# EAGLE design Adafruit NeoPixel Ring 24 B - Holder 4 (EAGLE 9.6.2)
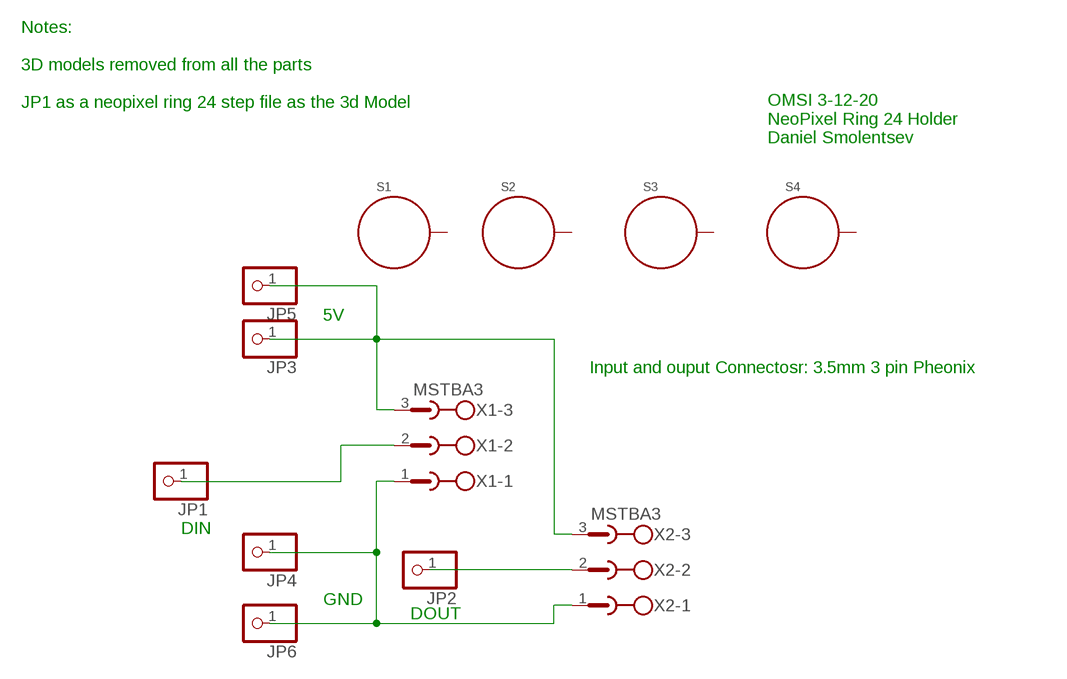
[diagram p0: schematic, sheet 1]

## Parts
JP1  PINHD-1X1CB  [1X01-CLEANBIG]
JP2  PINHD-1X1CB  [1X01-CLEANBIG]
JP3  PINHD-1X1CB  [1X01-CLEANBIG]
JP4  PINHD-1X1CB  [1X01-CLEANBIG]
JP5  PINHD-1X1CB  [1X01-CLEANBIG]
JP6  PINHD-1X1CB  [1X01-CLEANBIG]
S1  STANDOFF_ELECTRICAL.17"  [STANDOFF-ELECTRICAL]
S2  STANDOFF_ELECTRICAL.17"  [STANDOFF-ELECTRICAL]
S3  STANDOFF_ELECTRICAL.17"  [STANDOFF-ELECTRICAL]
S4  STANDOFF_ELECTRICAL.17"  [STANDOFF-ELECTRICAL]
X1  MSTBA3  [MSTBA3]
X2  MSTBA3  [MSTBA3]

## Nets
5V: JP3.1 JP5.1 X1.3 X2.3
DIN: JP1.1 X1.2
GND: JP4.1 JP6.1 X1.1 X2.1
N$1: JP2.1 X2.2
Unconnected: S1.P1 S2.P1 S3.P1 S4.P1

## Notes on the sheet
- Notes:
  
  3D models removed from all the parts
  
  JP1 as a neopixel ring 24 step file as the 3d Model
- OMSI 3-12-20
  NeoPixel Ring 24 Holder
  Daniel Smolentsev
- 5V
- Input and ouput Connectosr: 3.5mm 3 pin Pheonix
- DIN
- GND
- DOUT

## Library data of the parts
JP1-JP6 = NeoPixelRing:PINHD-1X1: Pin header 1x1 for 0.1" spacing With round pins
S1-S4 = th_libraries:STANDOFF_ELECTRICAL: A standoff intended to be an electrically connected point. Pad size and stop size allow for a #8 Phillips pan screw head to make a solid connection to the board. Added 144mill drill hole that fits my normal wood screw
X1 X2 = th_libraries:MSTBA3: PHOENIX; MF: FARNELL; MPN: 1757255; OC_FARNELL: 3705183; OC_NEWARK: 71C4162

## Board
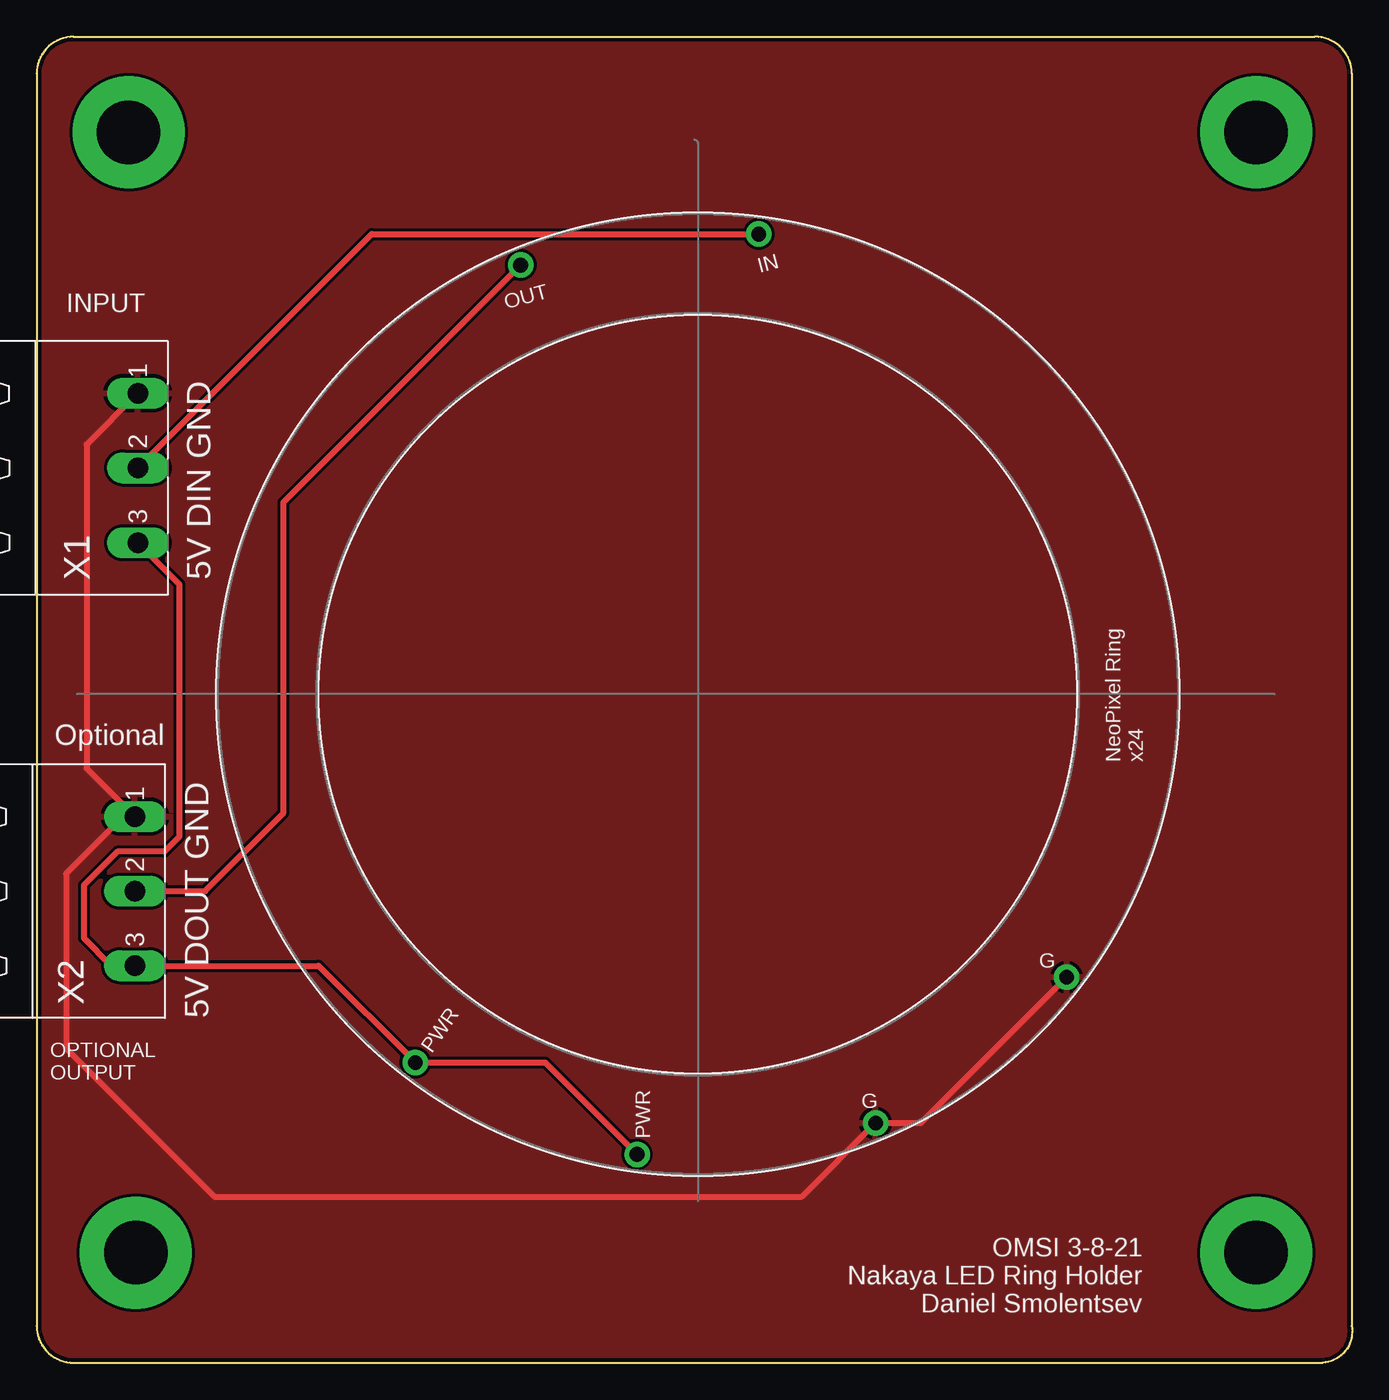
[diagram p1: board, top side]
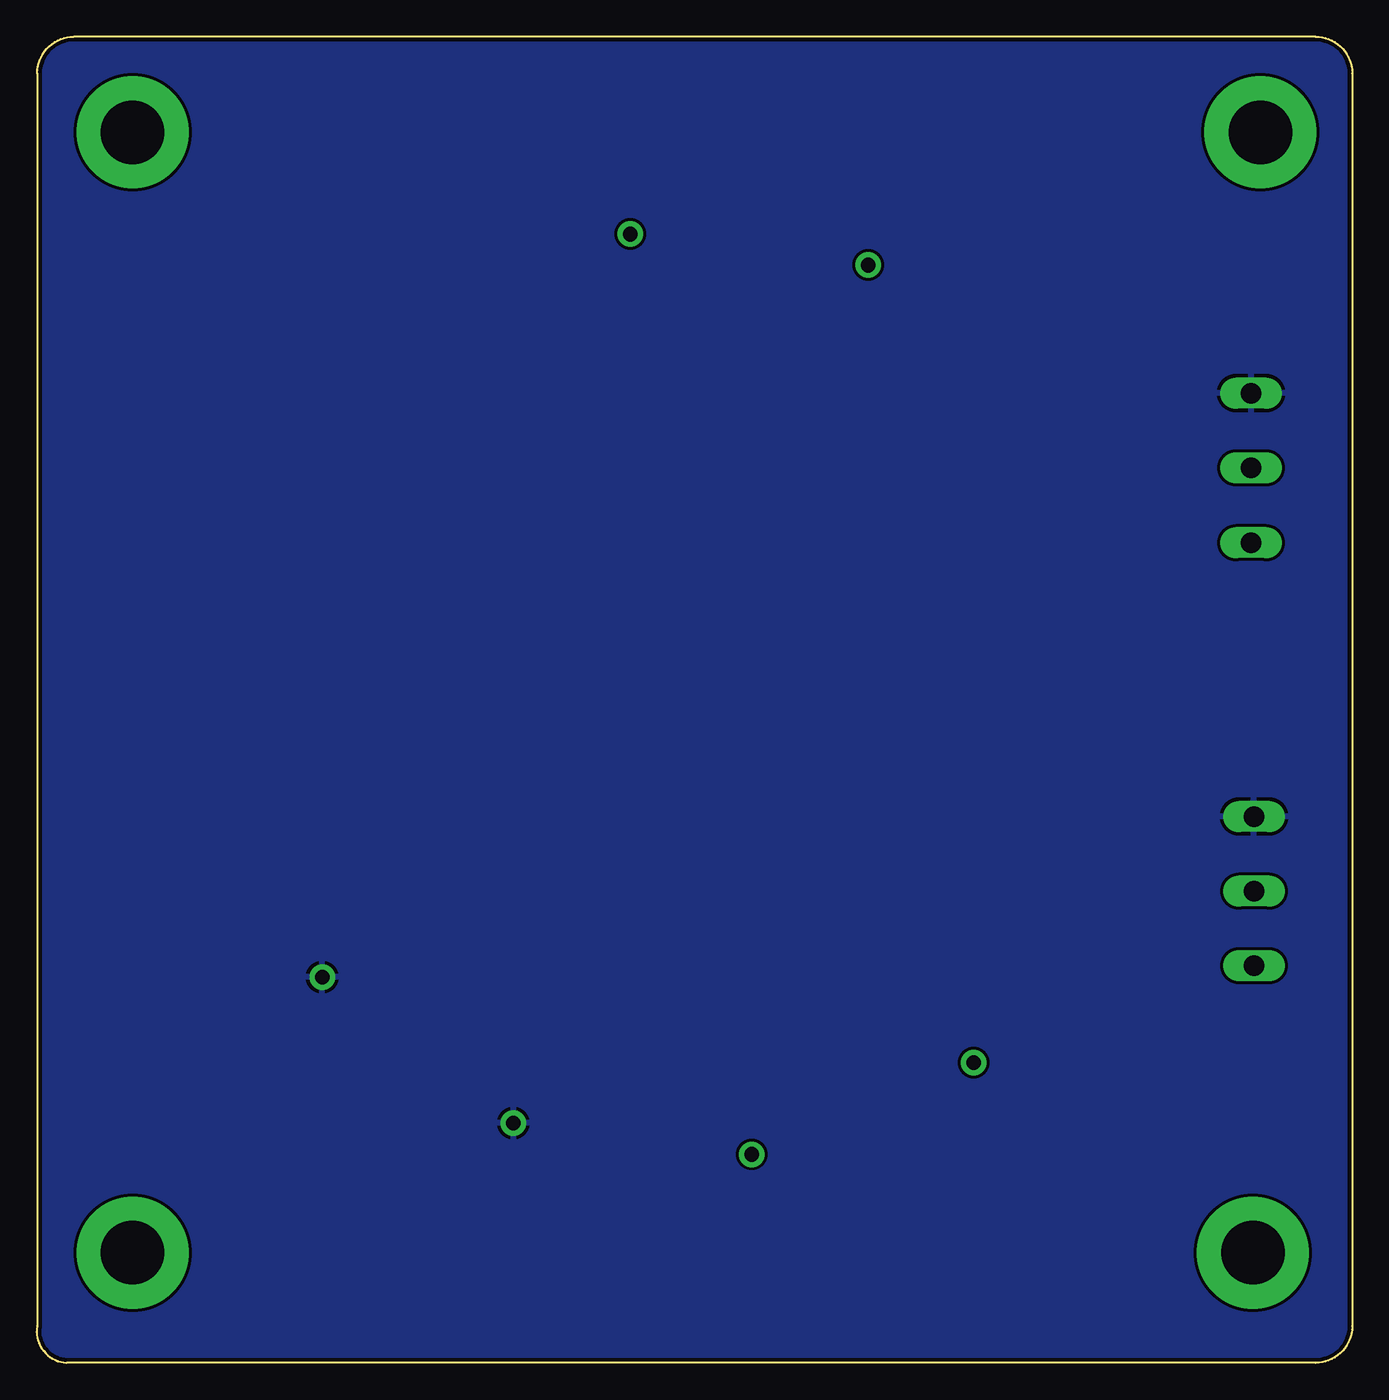
[diagram p2: board, bottom side, seen from below]

Size 89.53 x 90.25 mm. Coordinates in mm from the lower left corner, seen from the top.
Outline: 0,87.75 0,2.5 arc90 2.5,0 87.5,0 arc97 89.5,2.5 89.5,87.75 arc90 87,90.25 2.5,90.25 arc90 0,87.75
Copper layers (1*16): Top 0.035mm / dielectric 1.5mm / Bottom 0.035mm
Design rules "adafruit": minimum track width 8mil, minimum drill 15.5mil, track to track 8mil, track to pad 8mil, pad to pad 8mil, via to via 8mil, smd to smd 8mil, copper to edge 10mil, drill to drill 8mil, minimum pad ring 10mil, minimum via ring 8mil, stop-mask expansion 4mil, vias tented up to drill 20mil, thermal gap 10mil

### Footprints (pad centres in the part's own frame; a part is rotated, then mirrored left to right if it is on the bottom)
1X01-CLEANBIG = drill 1 pad 1.727: 1 0,0
STANDOFF-ELECTRICAL = drill 4.318 pad 7.62: P1 0,0
MSTBA3 = drill 1.397 long: 1 -5.08,5.08; 2 0,5.08; 3 5.08,5.08

### Placement (x,y rotation side)
JP1  49.14,76.82 0 top
JP2  32.94,74.71 0 top
JP3  40.86,14.18 0 top
JP4  57.09,16.32 0 top
JP5  25.77,20.43 0 top
JP6  70.1,26.25 0 top
S1  6.75,7.5 0 top
S2  83,7.5 0 top
S3  83,83.75 0 top
S4  6.25,83.75 0 top
X1  1.8,60.9 270 top
X2  1.6,32.1 270 top

### Tracks (layer width: path | path; a pad name or v marks a point on that pad's centre or on a via)
5V
  Top 0.406: JP3.1 34.61,20.43 JP5.1 19.18,27.02 X2.3 5.08,27.02 3.2,28.9 3.2,32.5 5.5,34.8 8.7,34.8 9.7,35.8 9.7,53 X1.3
DIN
  Top 0.406: X1.2 22.8,76.82 JP1.1
GND
  Top 0.406: X1.1 3.4,62.5 3.4,40.46 X2.1 5.88,37.18 2,33.3 2,21.4 12.1,11.3 52.08,11.3 JP4.1 60.16,16.32 JP6.1
  pour Top: -2.1,93.4 -2.1,-8 -1.9,-8.2 95.2,-8.2 97.6,-5.8 97.6,96.3 95.8,98.1 2.6,98.1
  pour Bottom: -1.7,95.7 99.7,95.7 99.9,95.5 99.9,-1.6 97.5,-4 -4.6,-4 -6.4,-2.2 -6.4,91
N$1
  Top 0.406: X2.2 11.48,32.1 16.8,37.42 16.8,58.58 JP2.1

### Text on the board
tPlace: IN | OUT | INPUT | 5V DIN GND | Optional | NeoPixel Ring / x24 | G | 5V DOUT GND | PWR | OPTIONAL / OUTPUT | G | PWR | OMSI 3-8-21 / Nakaya LED Ring Holder / Daniel Smolentsev